# Altium schematic sheet Sheet3.SchDoc
size A3; Organization: Altium Limited; Address1: L3, 12a Rodborough Rd; Address2: Frenchs Forest; Address3: NSW; Address4: Australia 2086; SheetNumber: 3; SheetTotal: 6
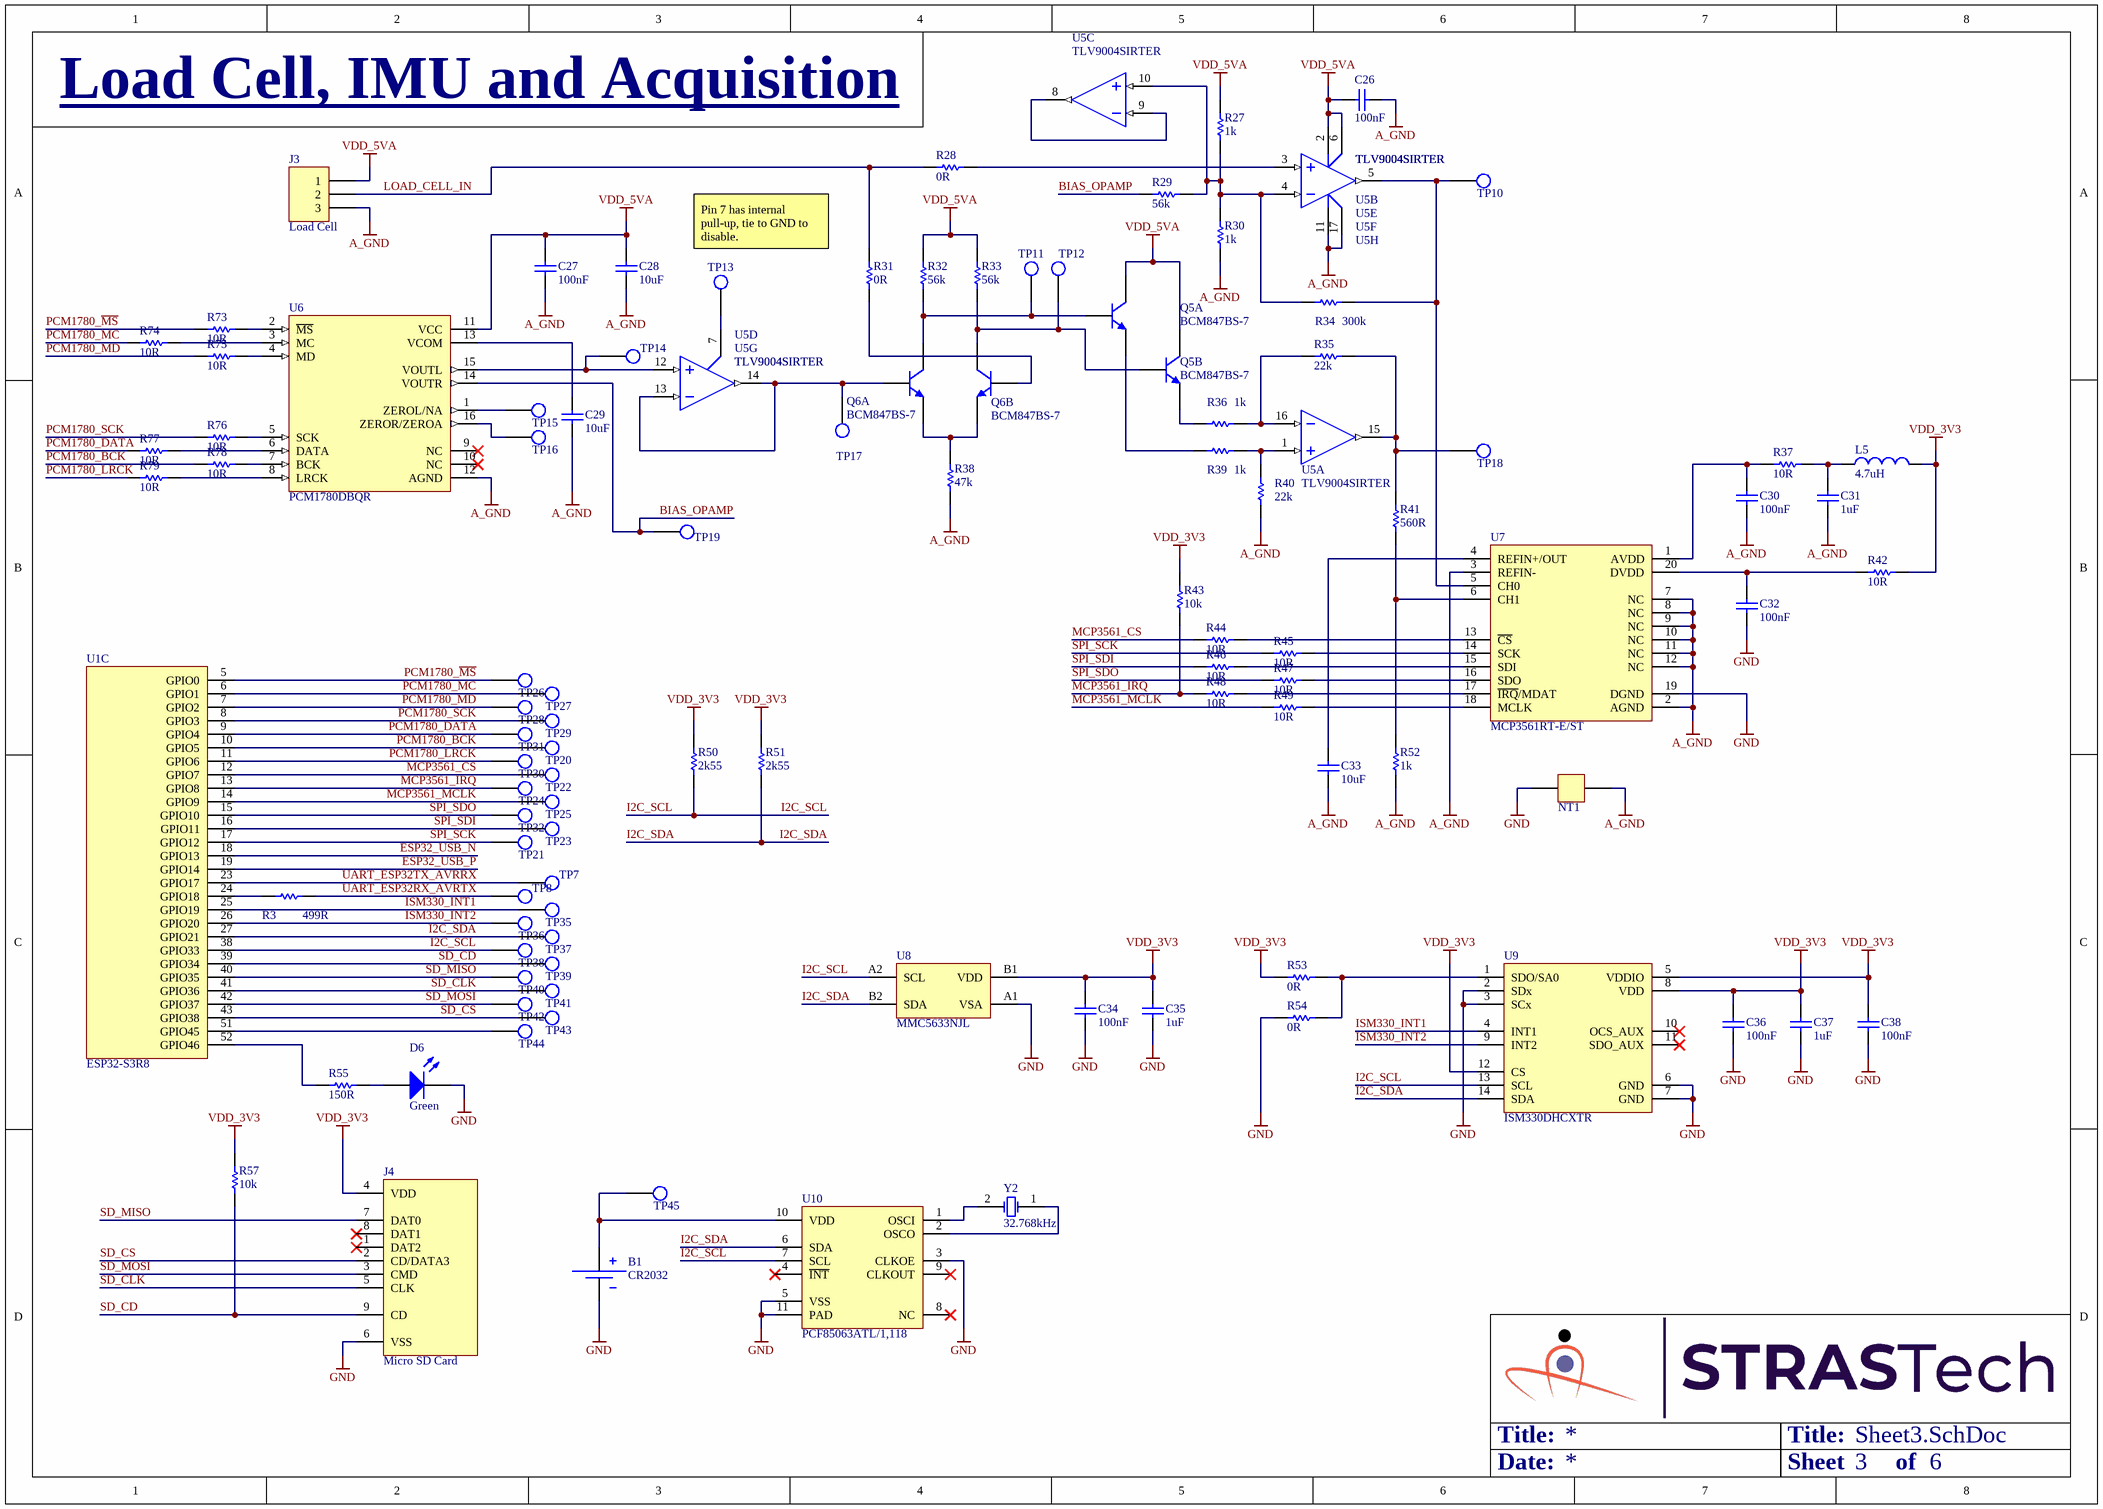
[diagram p0: Sheet3.SchDoc]

## Parts
B1  CR2032  [Holder,Cell,CR2032,PCB,SMD]
C26  100nF  [Cap,SMD,0402]
C27  100nF  [Cap,SMD,0402]
C28  10uF  [Cap,SMD,0402]
C29  10uF  [Cap,SMD,0402]
C30  100nF  [Cap,SMD,0402]
C31  1uF  [Cap,SMD,0402]
C32  100nF  [Cap,SMD,0402]
C33  10uF  [Cap,SMD,0402]
C34  100nF  [Cap,SMD,0402]
C35  1uF  [Cap,SMD,0402]
C36  100nF  [Cap,SMD,0402]
C37  1uF  [Cap,SMD,0402]
C38  100nF  [Cap,SMD,0402]
D6  Green  [LED,0603]
J3  Term,Header,3 Pin,Top,2.54mm  [Term,Header,3Pin,2.54mm]  (value not drawn)
J4  Micro SD Card  [Conn,MicroSD,Push-Push,SMD]
L5  4.7uH  [IND,0805]
NT1  Net Tie  [Net Tie,20x60mil]  (value not drawn)  (net tie, no BOM)
Q5  BCM847BS-7  [SOT363]  (parts A,B of 2)
Q6  BCM847BS-7  [SOT363]  (parts A,B of 2)
R3  499R  [RES,0402]
R27  1k  [RES,0402]
R28  0R  [RES,0402]
R29  56k  [RES,0402]
R30  1k  [RES,0402]
R31  0R  [RES,0402]
R32  56k  [RES,0402]
R33  56k  [RES,0402]
R34  300k  [RES,0402]
R35  22k  [RES,0402]
R36  1k  [RES,0402]
R37  10R  [RES,0402]
R38  47k  [RES,0402]
R39  1k  [RES,0402]
R40  22k  [RES,0402]
R41  560R  [RES,0402]
R42  10R  [RES,0402]
R43  10k  [RES,0402]
R44  10R  [RES,0402]
R45  10R  [RES,0402]
R46  10R  [RES,0402]
R47  10R  [RES,0402]
R48  10R  [RES,0402]
R49  10R  [RES,0402]
R50  2k55  [RES,0402]
R51  2k55  [RES,0402]
R52  1k  [RES,0402]
R53  0R  [RES,0402]
R54  0R  [RES,0402]
R55  150R  [RES,0402]
R57  10k  [RES,0402]
R73  10R  [RES,0402]
R74  10R  [RES,0402]
R75  10R  [RES,0402]
R76  10R  [RES,0402]
R77  10R  [RES,0402]
R78  10R  [RES,0402]
R79  10R  [RES,0402]
TP7  TESTPOINT  [testpoint,smd,round,1mm]  (value not drawn)
TP8  TESTPOINT  [testpoint,smd,round,1mm]  (value not drawn)
TP10  TESTPOINT  [testpoint,smd,round,1mm]  (value not drawn)
TP11  TESTPOINT  [testpoint,smd,round,1mm]  (value not drawn)
TP12  TESTPOINT  [testpoint,smd,round,1mm]  (value not drawn)
TP13  TESTPOINT  [testpoint,smd,round,1mm]  (value not drawn)
TP14  TESTPOINT  [testpoint,smd,round,1mm]  (value not drawn)
TP15  TESTPOINT  [testpoint,smd,round,1mm]  (value not drawn)
TP16  TESTPOINT  [testpoint,smd,round,1mm]  (value not drawn)
TP17  TESTPOINT  [testpoint,smd,round,1mm]  (value not drawn)
TP18  TESTPOINT  [testpoint,smd,round,1mm]  (value not drawn)
TP19  TESTPOINT  [testpoint,smd,round,1mm]  (value not drawn)
TP20  TESTPOINT  [testpoint,smd,round,1mm]  (value not drawn)
TP21  TESTPOINT  [testpoint,smd,round,1mm]  (value not drawn)
TP22  TESTPOINT  [testpoint,smd,round,1mm]  (value not drawn)
TP23  TESTPOINT  [testpoint,smd,round,1mm]  (value not drawn)
TP24  TESTPOINT  [testpoint,smd,round,1mm]  (value not drawn)
TP25  TESTPOINT  [testpoint,smd,round,1mm]  (value not drawn)
TP26  TESTPOINT  [testpoint,smd,round,1mm]  (value not drawn)
TP27  TESTPOINT  [testpoint,smd,round,1mm]  (value not drawn)
TP28  TESTPOINT  [testpoint,smd,round,1mm]  (value not drawn)
TP29  TESTPOINT  [testpoint,smd,round,1mm]  (value not drawn)
TP30  TESTPOINT  [testpoint,smd,round,1mm]  (value not drawn)
TP31  TESTPOINT  [testpoint,smd,round,1mm]  (value not drawn)
TP32  TESTPOINT  [testpoint,smd,round,1mm]  (value not drawn)
TP35  TESTPOINT  [testpoint,smd,round,1mm]  (value not drawn)
TP36  TESTPOINT  [testpoint,smd,round,1mm]  (value not drawn)
TP37  TESTPOINT  [testpoint,smd,round,1mm]  (value not drawn)
TP38  TESTPOINT  [testpoint,smd,round,1mm]  (value not drawn)
TP39  TESTPOINT  [testpoint,smd,round,1mm]  (value not drawn)
TP40  TESTPOINT  [testpoint,smd,round,1mm]  (value not drawn)
TP41  TESTPOINT  [testpoint,smd,round,1mm]  (value not drawn)
TP42  TESTPOINT  [testpoint,smd,round,1mm]  (value not drawn)
TP43  TESTPOINT  [testpoint,smd,round,1mm]  (value not drawn)
TP44  TESTPOINT  [testpoint,smd,round,1mm]  (value not drawn)
TP45  TESTPOINT  [testpoint,smd,round,1mm]  (value not drawn)
U1  ESP32-S3R8  [IC,QFN-56,7X7,P0.4MM]  (part C of 3)
U5  TLV9004SIRTER  [IC,QFN-16,3x3]  (parts A,B,C,D,E,F,G,H of 8)
U6  PCM1780DBQR  [IC,TSSOP-16,W3.9,P0.635MM]
U7  MCP3561RT-E/ST  [IC,TSSOP-20,W4.4]
U8  MMC5633NJL  [IC,WLP,2x2,P0.4mm]
U9  ISM330DHCXTR  [IC,LGA-14L,2.5x3mm]
U10  PCF85063ATL/1,118  [IC,DFN-10_3x3,P0.5mm]
Y2  32.768kHz  [XTAL,SMD,2PIN,2.0x1.2MM]

## Nets
A_GND: C26.1 C27.1 C28.1 C29.2 C30.1 C31.1 C33.1 J3.3 NT1.2 R30.1 R38.1 R40.1 R52.1 U5.11(V-) U5.17(PAD) U6.12(AGND) U7.2(AGND) U7.3(REFIN-) U7.7(NC) U7.8(NC) U7.9(NC) U7.10(NC) U7.11(NC) U7.12(NC)
GND: B1.2(BATT_N) C32.1 C34.2 C35.1 C36.1 C37.1 C38.1 D6.2(K) J4.6(VSS) NT1.1 R54.1 U7.19(DGND) U8.A1(VSA) U9.2(SDx) U9.3(SCx) U9.6(GND) U9.7(GND) U10.3(CLKOE) U10.5(VSS) U10.11(PAD)
VDD_3V3: C34.1 C35.2 C36.2 C37.2 C38.2 J4.4(VDD) L5.2 R42.2 R43.2 R50.2 R51.2 R53.1 R57.2 U8.B1(VDD) U9.5(VDDIO) U9.8(VDD) U9.12(CS)
VDD_5VA: C26.2 C27.2 C28.2 J3.1 Q5.3(C2) Q5.6(C1) R27.1 R32.2 R33.2 U5.2(V+) U5.6(~{SHDN}12) U6.11(VCC)
BIAS_OPAMP: R29.2 TP19.1(TP) U6.14(VOUTR)
ESP32_USB_N: U1.18(GPIO13)
ESP32_USB_P: U1.19(GPIO14)
I2C_SCL: R50.1 TP38.1(TP) U1.38(GPIO33) U8.A2(SCL) U9.13(SCL) U10.7(SCL)
I2C_SDA: R51.1 TP37.1(TP) U1.27(GPIO21) U8.B2(SDA) U9.14(SDA) U10.6(SDA)
ISM330_INT1: TP35.1(TP) U1.25(GPIO19) U9.4(INT1)
ISM330_INT2: TP36.1(TP) U1.26(GPIO20) U9.9(INT2)
LOAD_CELL_IN: J3.2 R28.1 R31.1
MCP3561_CS: R44.1 TP22.1(TP) U1.12(GPIO7)
MCP3561_IRQ: R43.1 R48.1 TP24.1(TP) U1.13(GPIO8)
MCP3561_MCLK: R49.1 TP25.1(TP) U1.14(GPIO9)
PCM1780_BCK: R78.1 TP20.1(TP) U1.10(GPIO5)
PCM1780_DATA: R77.1 TP31.1(TP) U1.9(GPIO4)
PCM1780_LRCK: R79.1 TP30.1(TP) U1.11(GPIO6)
PCM1780_~{MS}: R73.1 TP26.1(TP) U1.5(GPIO0)
PCM1780_MC: R74.1 TP27.1(TP) U1.6(GPIO1)
PCM1780_MD: R75.1 TP28.1(TP) U1.7(GPIO2)
PCM1780_SCK: R76.1 TP29.1(TP) U1.8(GPIO3)
SD_CD: J4.9(CD) R57.1 TP39.1(TP) U1.39(GPIO34)
SD_CLK: J4.5(CLK) TP41.1(TP) U1.41(GPIO36)
SD_CS: J4.2(CD/DATA3) TP43.1(TP) U1.43(GPIO38)
SD_MISO: J4.7(DAT0) TP40.1(TP) U1.40(GPIO35)
SD_MOSI: J4.3(CMD) TP42.1(TP) U1.42(GPIO37)
SPI_SCK: R45.1 TP21.1(TP) U1.17(GPIO12)
SPI_SDI: R46.1 TP23.1(TP) U1.16(GPIO11)
SPI_SDO: R47.1 TP32.1(TP) U1.15(GPIO10)
UART_ESP32RX_AVRTX: R3.2 TP8.1(TP)
UART_ESP32TX_AVRRX: TP7.1(TP) U1.23(GPIO17)
NetB1_1: B1.1(BATT_P) TP45.1(TP) U10.10(VDD)
NetC29_1: C29.1 U6.13(VCOM)
NetC30_2: C30.2 R37.1 U7.1(AVDD)
NetC31_2: C31.2 L5.1 R37.2
NetC32_2: C32.2 R42.1 U7.20(DVDD)
NetC33_2: C33.2 U7.4(REFIN+/OUT)
NetD6_1: D6.1(A) R55.1
NetQ5_1: Q5.1(E1) R39.1
NetQ5_2: Q5.2(B1) Q6.6(C1) R32.1 TP11.1(TP)
NetQ5_4: Q5.4(E2) R36.1
NetQ5_5: Q5.5(B2) Q6.3(C2) R33.1 TP12.1(TP)
NetQ6_1: Q6.1(E1) Q6.4(E2) R38.2
NetQ6_2: Q6.2(B1) TP17.1(TP) U5.13(IN4-) U5.14(OUT4)
NetQ6_5: Q6.5(B2) R31.2
NetR3_1: R3.1 U1.24(GPIO18)
NetR27_2: R27.2 R29.1 R30.2 R34.2 U5.4(IN2-) U5.10(IN3+)
NetR28_2: R28.2 U5.3(IN2+)
NetR34_1: R34.1 TP10.1(TP) U5.5(OUT2) U7.5(CH0)
NetR35_1: R35.1 R41.2 TP18.1(TP) U5.15(OUT1)
NetR35_2: R35.2 R36.2 U5.16(IN1-)
NetR39_2: R39.2 R40.2 U5.1(IN1+)
NetR41_1: R41.1 R52.2 U7.6(CH1)
NetR44_2: R44.2 U7.13(~{CS})
NetR45_2: R45.2 U7.14(SCK)
NetR46_2: R46.2 U7.15(SDI)
NetR47_2: R47.2 U7.16(SDO)
NetR48_2: R48.2 U7.17(~{IRQ}/MDAT)
NetR49_2: R49.2 U7.18(MCLK)
NetR53_2: R53.2 R54.2 U9.1(SDO/SA0)
NetR55_2: R55.2 U1.52(GPIO46)
NetR73_2: R73.2 U6.2(~{MS})
NetR74_2: R74.2 U6.3(MC)
NetR75_2: R75.2 U6.4(MD)
NetR76_2: R76.2 U6.5(SCK)
NetR77_2: R77.2 U6.6(DATA)
NetR78_2: R78.2 U6.7(BCK)
NetR79_2: R79.2 U6.8(LRCK)
NetTP13_1: TP13.1(TP) U5.7(~{SHDN}34)
NetTP14_1: TP14.1(TP) U5.12(IN4+) U6.15(VOUTL)
NetTP15_1: TP15.1(TP) U6.1(ZEROL/NA)
NetTP16_1: TP16.1(TP) U6.16(ZEROR/ZEROA)
NetTP44_1: TP44.1(TP) U1.51(GPIO45)
NetU5_8: U5.8(OUT3) U5.9(IN3-)
NetU10_1: U10.1(OSCI) Y2.2(GND)
NetU10_2: U10.2(OSCO) Y2.1(OSC1)

Not connected (* = marked no-connect by the designer): J4 1(DAT2)* 8(DAT1)*; U6 9(NC)* 10(NC)*; U9 10(OCS_AUX)* 11(SDO_AUX)*; U10 4(~{INT})* 8(NC)* 9(CLKOUT)*

## Notes on the sheet
- Load Cell, IMU and Acquisition
- (near J3) Load Cell
- Pin 7 has internal pull-up, tie to GND to disable.
- Title:
- Date:
- Sheet
- of
- Title
- Size:
- A3
- Revision:
- Design By:

## Library data of the parts
B1 = Holder,Cell,CR2032,PCB,SMD: Battery Retainer Coin, 20.0mm 1 Cell SMD (SMT) Tab; Manufacturer: Keystone Electronics; Manufacturer Part Number: 3034; Vendor Part Number: 36-3034-ND; Vendor: Digikey; CreatedBy: Judd Foster; HelpURL: https://www.keyelco.com/userAssets/file/M65p9.pdf
C26 C27 C30 C32 C34 C36 C38 = CAP,Cer,100nF,25VDC,X7R,0402: 0.1µF ±10% 25V Ceramic Capacitor X7R 0402 (1005 Metric); Vendor Part Number: 490-14603-1-ND; Manufacturer: Murata Electronics; Manufacturer Part Number: GRM155R71E104KE14J; Vendor: Digikey; HelpURL: https://search.murata.co.jp/Ceramy/image/img/A01X/G101/ENG/GRM155R71E104KE14-01.pdf; CreatedBy: Judd Foster
C28 C29 C33 = CAP,Cer,10uF,10VDC,X5R,0402: 10 µF ±20% 10V Ceramic Capacitor X5R 0402 (1005 Metric); Vendor Part Number: 1276-1450-1-ND; Manufacturer: Samsung Electro-Mechanics; Manufacturer Part Number: CL05A106MP5NUNC; Vendor: Digikey; HelpURL: https://media.digikey.com/pdf/Data%20Sheets/Samsung%20PDFs/CL05A106MP5NUNC_Spec.pdf; CreatedBy: Judd Foster
C31 C35 C37 = CAP,Cer,1uF,35VDC,X5R,0402: 1 µF ±10% 35V Ceramic Capacitor X5R 0402 (1005 Metric); Vendor Part Number: 445-9073-1-ND; Manufacturer: TDK Corporation; Manufacturer Part Number: C1005X5R1V105K050BC; Vendor: Digikey; HelpURL: https://product.tdk.com/info/en/catalog/datasheets/mlcc_commercial_general_en.pdf?ref_disty=digikey; CreatedBy: Judd Foster
D6 = LED,Green,SMD,0603: Green 530nm LED Indication - Discrete 3V 0603 (1608 Metric); Manufacturer: Stanley Electric Co; Manufacturer Part Number: THG1111C-0005-TR; Vendor Part Number: 404-1286-1-ND; Vendor: Digikey; CreatedBy: Judd Foster; HelpURL: http://www.stanley-components.com/php/downloaddatafile.php?rp=0,THG1111C-0005_e.pdf
J3 = Term,Header,3 Pin,Top,2.54mm: CONN HEADER VERT 3POS 2.54MM; Vendor Part Number: 732-5316-ND; Manufacturer: Würth Elektronik; Manufacturer Part Number: 61300311121; Vendor: Digikey; HelpURL: https://katalog.we-online.de/em/datasheet/6130xx11121.pdf; Created By: Judd Foster
J4 = Conn,MicroSD,SMD,Push-Push: 9 (8 + 1) Position Card Connector Secure Digital - microSD™ Surface Mount, Right Angle Gold; Manufacturer: GCT; Manufacturer Part Number: MEM2075-00-140-01-A; Vendor Part Number: 2073-MEM2075-00-140-01-ACT-ND; Vendor: Digikey; CreatedBy: Judd Foster; HelpURL: https://gct.co/files/specs/MEM2075-SPEC.pdf
L5 = IND,4.7uH,80mA,Multilayer,0805: 4.7 µH Shielded Multilayer Inductor 80 mA 300mOhm 0805 (2012 Metric); Vendor Part Number: 445-3169-1-ND; Manufacturer: TDK Corporation; Manufacturer Part Number: MLZ2012E4R7MT000; Vendor: Digikey; HelpURL: https://product.tdk.com/en/system/files?file=dam/doc/product/inductor/inductor/smd/catalog/inductor_commercial_decoupling_mlz2012_en.pdf; CreatedBy: Judd Foster
Q5 Q6 = Trans,Array,NPN/NPN,Matched,45V,100mA,SOT-363: Bipolar (BJT) Transistor Array 2 NPN (Dual) Matched Pair 45V 100mA 100MHz 200mW Surface Mount SOT-363; Manufacturer: Diodes Incorporated; Vendor Part Number: 31-BCM847BS-7CT-ND; Vendor: Digikey; CreatedBy: Judd Foster; HelpURL: https://www.diodes.com/assets/Datasheets/BCM847BS.pdf; Manufacturer Part Number: BCM847BS-7
R3 = RES,499R,1%,0.063W,0402: 499 Ohms ±1% 0.063W, 1/16W Chip Resistor 0402 (1005 Metric) Automotive AEC-Q200 Thick Film; Manufacturer: Stackpole Electronics Inc; Manufacturer Part Number: RMCF0402FT499R; Vendor Part Number: RMCF0402FT499RCT-ND; Vendor: Digikey; CreatedBy: Judd Foster; HelpURL: https://www.seielect.com/catalog/sei-rmcf_rmcp.pdf
R27 R30 R36 R39 R52 = RES,1k,5%,0.063W,0402: 1 kOhms ±5% 0.063W, 1/16W Chip Resistor 0402 (1005 Metric) Automotive AEC-Q200 Thick Film; Vendor Part Number: RMCF0402JT1K00CT-ND; Manufacturer: Stackpole Electronics Inc; Manufacturer Part Number: RMCF0402JT1K00; Vendor: DIgikey; HelpURL: https://www.seielect.com/catalog/sei-rmcf_rmcp.pdf; CreatedBy: Judd Foster
R28 R31 R53 R54 = RES,0R0,0.1W,0402: 0 Ohms Jumper 0.1W, 1/10W Chip Resistor 0402 (1005 Metric) Automotive AEC-Q200 Thick Film; Manufacturer: Panasonic Electronic Components; Manufacturer Part Number: ERJ-2GE0R00X; Vendor Part Number: P0.0JCT-ND; Vendor: Digikey; CreatedBy: Judd Foster; HelpURL: https://industrial.panasonic.com/cdbs/www-data/pdf/RDA0000/AOA0000C301.pdf
R29 R32 R33 = RES,56k,1%,0.063W,0402: 56 kOhms ±1% 0.1W, 1/10W Chip Resistor 0402 (1005 Metric) Automotive AEC-Q200 Thick Film; Manufacturer: Panasonic Electronic Components; Manufacturer Part Number: ERJ-2RKF5602X; Vendor Part Number: P56.0KLCT-ND; Vendor: Digikey; CreatedBy: Judd Foster; HelpURL: https://industrial.panasonic.com/cdbs/www-data/pdf/RDA0000/AOA0000C304.pdf
R34 = RES,300k,1%,0.063W,0402: 300 kOhms ±1% 0.063W, 1/16W Chip Resistor 0402 (1005 Metric) Automotive AEC-Q200 Thick Film; Manufacturer: Stackpole Electronics Inc; Manufacturer Part Number: RMCF0402FT300K; Vendor Part Number: RMCF0402FT300KCT-ND; Vendor: Digikey; CreatedBy: Judd Foster; HelpURL: https://www.seielect.com/catalog/sei-rmcf_rmcp.pdf
R35 R40 = RES,22k,1%,0.063W,0402: 22 kOhms ±1% 0.063W, 1/16W Chip Resistor 0402 (1005 Metric) Automotive AEC-Q200 Thick Film; Vendor Part Number: RMCF0402FT22K0CT-ND; Manufacturer: Stackpole Electronics Inc; Manufacturer Part Number: RMCF0402FT22K0; Vendor: DIgikey; HelpURL: https://www.seielect.com/catalog/sei-rmcf_rmcp.pdf; CreatedBy: Judd Foster
R37 R42 R44-R49 R73-R79 = RES,10R,1%,0.063W,0402: 10 Ohms ±1% 0.063W, 1/16W Chip Resistor 0402 (1005 Metric) Automotive AEC-Q200 Thick Film; Manufacturer: Panasonic Electronic Components; Manufacturer Part Number: ERJ-2RKF10R0X; Vendor Part Number: P10.0LCT-ND; Vendor: Digikey; CreatedBy: Judd Foster; HelpURL: https://industrial.panasonic.com/cdbs/www-data/pdf/RDA0000/AOA0000C304.pdf
R38 = RES,47k,1%,0.1W,0402: 47 kOhms ±1% 0.1W, 1/10W Chip Resistor 0402 (1005 Metric) Automotive AEC-Q200 Thick Film; Manufacturer: Panasonic Electronic Components; Manufacturer Part Number: ERJ-2RKF4702X; Vendor Part Number: P47.0KLCT-ND; Vendor: Digikey; CreatedBy: Judd Foster; HelpURL: https://industrial.panasonic.com/cdbs/www-data/pdf/RDA0000/AOA0000C304.pdf
R41 = RES,560R,1%,0.063W,0402: 560 Ohms ±1% 0.063W, 1/16W Chip Resistor 0402 (1005 Metric) Automotive AEC-Q200, Moisture Resistant Thick Film; Manufacturer: TE Connectivity Passive Product; Manufacturer Part Number: CRGCQ0402F560R; Vendor Part Number: A129624CT-ND; Vendor: Digikey; CreatedBy: Judd Foster; HelpURL: https://www.te.com/commerce/DocumentDelivery/DDEController?Action=srchrtrv&DocNm=1773204-3&DocType=DS&DocLang=English
R43 R57 = RES,10k,5%,0.063W,0402: 10 kOhms ±5% 0.063W, 1/16W Chip Resistor 0402 (1005 Metric) Automotive AEC-Q200 Thick Film; Vendor Part Number: RMCF0402JT10K0CT-ND; Manufacturer: Stackpole Electronics Inc; Manufacturer Part Number: RMCF0402JT10K0; Vendor: DIgikey; HelpURL: https://www.seielect.com/catalog/sei-rmcf_rmcp.pdf; CreatedBy: Judd Foster
R50 R51 = RES,2k55,1%,0.063W,0402: 2.55 kOhms ±1% 0.063W, 1/16W Chip Resistor 0402 (1005 Metric) Automotive AEC-Q200 Thick Film; Manufacturer: Stackpole Electronics Inc; Manufacturer Part Number: RMCF0402FT2K55; Vendor Part Number: RMCF0402FT2K55CT-ND; Vendor: Digikey; CreatedBy: Judd Foster; HelpURL: https://www.seielect.com/catalog/sei-rmcf_rmcp.pdf
R55 = RES,150R,1%,0.1W,0402: 150 Ohms ±1% 0.063W, 1/16W Chip Resistor 0402 (1005 Metric) Automotive AEC-Q200, Moisture Resistant Thick Film; Manufacturer: TE Connectivity Passive Product; Manufacturer Part Number: CRGCQ0402F150R; Vendor Part Number: A129617CT-ND; Vendor: Digikey; CreatedBy: Judd Foster; HelpURL: https://www.te.com/commerce/DocumentDelivery/DDEController?Action=srchrtrv&DocNm=1773204-3&DocType=DS&DocLang=English
TP7 TP8 TP10-TP32 TP35-TP45 = TESTPOINT: PCB Testpoint; CreatedBy: Judd Foster; HelpURL: N/A; Manufacturer: N/A; Manufacturer Part Number: N/A; Vendor: N/A; Vendor Part Number: N/A
U1 = ESP32-S3R8: IC RF TxRx + MCU Bluetooth, WiFi 802.11b/g/n, Bluetooth v5.0 2.412GHz ~ 2.484GHz 56-VFQFN Exposed Pad; Manufacturer: Espressif Systems; Vendor Part Number: 1904-ESP32-S3R8-ND; Vendor: Digikey; CreatedBy: Judd Foster; HelpURL: https://www.espressif.com/sites/default/files/documentation/esp32-s3_datasheet_en.pdf; Manufacturer Part Number: ESP32-S3R8
U5 = TLV9004SIRTER: General Purpose Amplifier 4 Circuit Rail-to-Rail 16-WQFN (3x3); Manufacturer: Texas Instruments; Vendor Part Number: 296-51829-1-ND; Vendor: Digikey; CreatedBy: Judd Foster; HelpURL: https://www.ti.com/general/docs/suppproductinfo.tsp?distId=10&gotoUrl=https%3A%2F%2Fwww.ti.com%2Flit%2Fgpn%2Ftlv9004; Manufacturer Part Number: TLV9004SIRTER
U6 = PCM1780DBQR: DAC, Audio 24 b 200k I²S 16-SSOP; Manufacturer: Texas Instruments; Vendor Part Number: 296-41373-1-ND; Vendor: Digikey; Manufacturer Part Number: PCM1780DBQR; HelpURL: https://www.ti.com/general/docs/suppproductinfo.tsp?distId=10&gotoUrl=https%3A%2F%2Fwww.ti.com%2Flit%2Fgpn%2Fpcm1780; CreatedBy: Judd Foster
U7 = MCP3561RT-E/ST: 24 Bit Analog to Digital Converter 1 Input 1 Sigma-Delta 20-TSSOP; Vendor Part Number: 150-MCP3561RT-E/STCT-ND; Manufacturer: Microchip Technology; Vendor: Digikey; Manufacturer Part Number: MCP3561RT-E/ST; HelpURL: https://ww1.microchip.com/downloads/en/DeviceDoc/MCP3561.2.4R-Data-Sheet-DS200006391A.pdf; CreatedBy: Judd Foster
U8 = MMC5633NJL: Magnetoresistive Sensor X, Y, Z Axis 4-WLP (0.85x0.85); Manufacturer: Memsic Inc.; Vendor Part Number: 1267-MMC5633NJLCT-ND; Vendor: Digikey; CreatedBy: Judd Foster; HelpURL: https://media.digikey.com/pdf/Data%20Sheets/MEMSIC%20PDFs/MMC5633NJL_RevA_3-12-20.pdf; Manufacturer Part Number: MMC5633NJL
U9 = ISM330DHCXTR: Accelerometer, Gyroscope, Temperature, 6 Axis Sensor I²C, SPI Output; Manufacturer: STMicroelectronics; Vendor Part Number: 497-19784-1-ND; Vendor: Digikey; CreatedBy: Judd Foster; HelpURL: https://www.st.com/resource/en/datasheet/ism330dhcx.pdf; Manufacturer Part Number: ISM330DHCXTR
U10 = PCF85063ATL/1,118: Real Time Clock (RTC) IC Clock/Calendar - I²C, 2-Wire Serial 10-XFDFN Exposed Pad; Manufacturer: NXP USA Inc.; Vendor Part Number: 568-10235-1-ND; Vendor: Digikey; CreatedBy: Judd Foster; HelpURL: https://www.nxp.com/docs/en/data-sheet/PCF85063A.pdf; Manufacturer Part Number: PCF85063ATL/1,118
Y2 = XTAL,32.768kHz,9pF,SMD: 32.768 kHz ±20ppm Crystal 9pF 70 kOhms 2-SMD, No Lead; Manufacturer: Micro Crystal AG; Manufacturer Part Number: CM8V-T1A-32.768KHZ-9PF-20PPM-TA-QC; Vendor Part Number: 2195-CM8V-T1A-32.768KHZ-9PF-20PPM-TA-QCCT-ND; Vendor: Digikey; CreatedBy: Judd Foster; HelpURL: https://www.microcrystal.com/fileadmin/Media/Products/32kHz/Datasheet/CM8V-T1A.pdf
NT1 = Net Tie: CreatedBy: Makan Mousavi; HelpURL: N/A; Manufacturer: N/A; Manufacturer Part Number: N/A; Vendor: N/A; Vendor Part Number: N/A